# Altium schematic sheet USB_Isolator.SchDoc
size A4; SheetNumber: 1; SheetTotal: 1
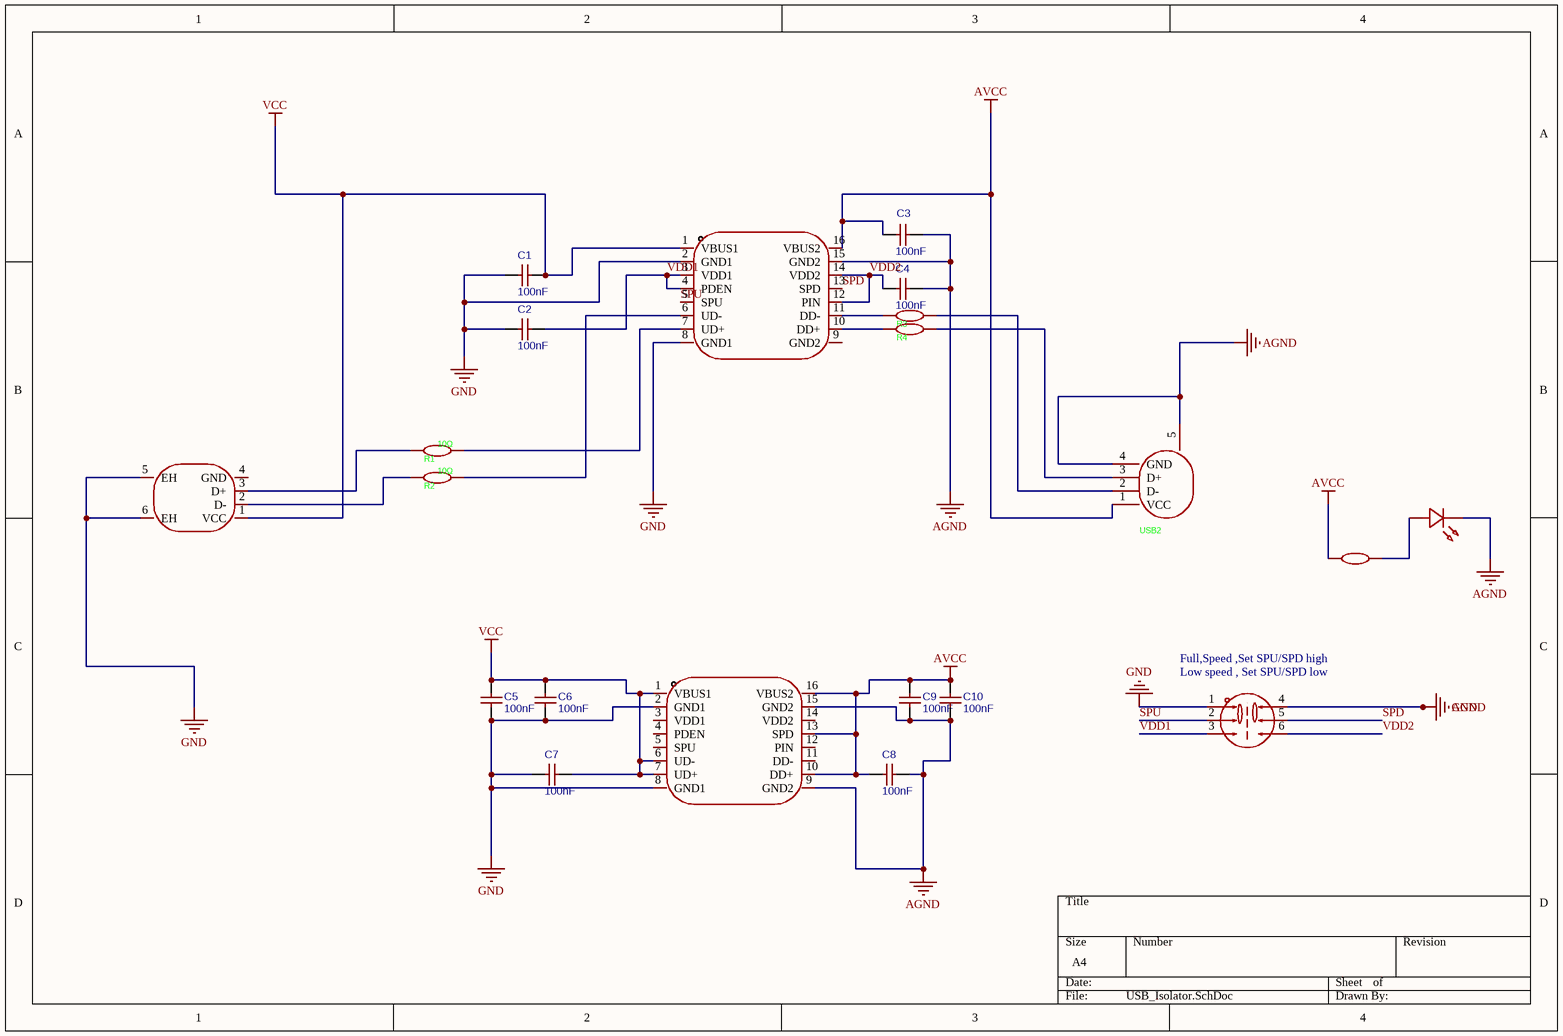
[diagram p0: USB_Isolator.SchDoc]

## Parts
C1  100nF  [100uF]
C2  100nF  [100uF]
C3  100nF  [100uF]
C4  100nF  [100uF]
C5  100nF  [100uF]
C6  100nF  [100uF]
C7  100nF  [100uF]
C8  100nF  [100uF]
C9  100nF  [100uF]
C10  100nF  [100uF]
LED1  XL-1608SURC-06  [LED]  (value not drawn)
R1  10Ω  [100K]
R2  10Ω  [100K]
R3  10Ω  [100K]  (value not drawn)
R4  10Ω  [100K]  (value not drawn)
R5  10Ω  [100K]  (value not drawn)
U2  KFC7070-Z  [Switch]  (value not drawn)
U?  ADUM4160BRWZ-RL  [USB ISOLATOR]  (value not drawn)
USB1  480372100  [USB MALE]  (value not drawn)
USB2  UE27AC54100  [USB TYPE- A]  (value not drawn)
USB_Isolator  ADUM4160BRWZ-RL  [USB ISOLATOR]  (value not drawn)

## Nets
AGND: C1.1 C2.1 C3.2 C4.2 C5.1 C6.1 C7.1 C8.2 C9.1 C10.1 LED1.1(K) U2.1 U2.4 U?.2(GND1) U?.8(GND1) U?.9(GND2) U?.15(GND2) USB1.5(EH) USB1.6(EH) USB2.4(GND) USB2.5(SHLD) USB_Isolator.2(GND1) USB_Isolator.8(GND1) USB_Isolator.15(GND2)  [also labelled GND]
AVCC: C3.1 C8.1 C9.2 C10.2 R5.1 U?.10(DD+) U?.13(SPD) U?.16(VBUS2) USB2.1(VCC) USB_Isolator.16(VBUS2)
VCC: C1.2 C5.2 C6.2 C7.2 U?.1(VBUS1) U?.6(UD-) U?.7(UD+) USB1.1(VCC) USB_Isolator.1(VBUS1)
SPD: U2.5 USB_Isolator.13(SPD)
SPU: U2.2 USB_Isolator.5(SPU)
VDD1: C2.2 U2.3 USB_Isolator.3(VDD1) USB_Isolator.4(PDEN)
VDD2: C4.1 U2.6 USB_Isolator.12(PIN) USB_Isolator.14(VDD2)
NetLED1_2: LED1.2(A) R5.2
NetR1_1: R1.1 USB1.3(D+)
NetR1_2: R1.2 USB_Isolator.7(UD+)
NetR2_1: R2.1 USB1.2(D-)
NetR2_2: R2.2 USB_Isolator.6(UD-)
NetR3_1: R3.1 USB_Isolator.11(DD-)
NetR3_2: R3.2 USB2.2(D-)
NetR4_1: R4.1 USB_Isolator.10(DD+)
NetR4_2: R4.2 USB2.3(D+)

Not connected (* = marked no-connect by the designer): U? 3(VDD1) 4(PDEN) 5(SPU) 11(DD-) 12(PIN) 14(VDD2); USB1 4(GND); USB_Isolator 9(GND2)

## Notes on the sheet
- (near U2) Full,Speed ,Set SPU/SPD high
- (near U2) Low speed , Set SPU/SPD low

## Library data of the parts
C1-C10 = 10uF: Manufacturer: SAMSUNG(三星); Manufacturer Part: CL10B104KO8NNNC; nameAlias: Value; Supplier: LCSC; Supplier Part: C66501; JLCPCB Part Class: Extended Part; spicePre: C; spiceSymbolName: CL10B104KO8NNNC
LED1 = LED: Manufacturer: XINGLIGHT(成兴光); Add into BOM: yes; Illumination Color: Red; Voltage - Forward(Vf): 2.3V; Power(Watts): 50mW; Forward Current: 20mA; Wavelength - Dominant: 620nm~630nm; Peak Wavelength: 625nm; Lens Color: Colorless Transparent Lens; Luminous Intensity: 225mcd; Viewing Angle: 120°; Mounting Sytle: Positive Stick; Symbol: XL-1608SURC-06; Device: XL-1608SURC-06; LCSC Part Name: XL-1608SURC-06; Supplier Part: C965799; Manufacturer Part: XL-1608SURC-06; Supplier Footprint: 0603; JLCPCB Part Class: Extended Part; Datasheet: https://atta.szlcsc.com/upload/public/pdf/source/20250213/F9766CE804AF391355DCDD48DB3E0DAB.pdf; Supplier: LCSC; Convert to PCB: yes; Lamp Holder Type: -; Diode Configuration: -; Color Temperature: -; Operating Temperature: -20℃~+85℃
R1-R5 = 10k: Manufacturer: YAGEO(国巨); Symbol: RC0603FR-0710RL; Add into BOM: yes; Tolerance: ±1%; Temperature Coefficient: ±200ppm/℃; Device: RC0603FR-0710RL; LCSC Part Name: 厚膜电阻 10Ω ±1% 100mW; Supplier Part: C109318; Manufacturer Part: RC0603FR-0710RL; Supplier Footprint: 0603; JLCPCB Part Class: Extended Part; Datasheet: https://atta.szlcsc.com/upload/public/pdf/source/20180316/70C0E2BDAE7FCC62C531A5A58D202EE1.pdf; Supplier: LCSC; Convert to PCB: yes; Type: Thick Film Resistors; Value: 10Ω; Operating Temperature Range: -55℃~+155℃
U2 = switch: Manufacturer: HanElectricity(瀚源); Add into BOM: yes; Symbol: KFC7070-Z; Device: KFC7070-Z; LCSC Part Name: KFC7070-Z; Supplier Part: C22459508; Manufacturer Part: KFC7070-Z; Supplier Footprint: DIP-6P,7x7mm; JLCPCB Part Class: Extended Part; Datasheet: https://atta.szlcsc.com/upload/public/pdf/source/20240605/2F47BAB787CC6253D9F5B83C0B3B0039.pdf; Supplier: LCSC; Convert to PCB: yes
U? = DC TO DC: Manufacturer: ADI(亚德诺); Device: ADUM4160BRWZ-RL_C57791; Add into BOM: yes; Symbol: ADUM4160BRWZ; LCSC Part Name: 全速/低速5kVUSB数字隔离器; Supplier Part: C57791; Manufacturer Part: ADUM4160BRWZ-RL; Supplier Footprint: SOIC-16-300mil; JLCPCB Part Class: Extended Part; Datasheet: https://atta.szlcsc.com/upload/public/pdf/source/20180327/C57791_1A1DC0BD2A9501538E79ECF10A1F69DF.pdf; Supplier: LCSC; Convert to PCB: yes
USB1 = USB MALE: Manufacturer: MOLEX; Symbol: 48037-2100; Add into BOM: yes; Connector Type: Type-A; Protocol Standard: USB 2.0; Gender: Male; Number of Contacts: 4P; Number of Ports: 1; Device: 480372100; LCSC Part Name: Type-A 公; Supplier Part: C136453; Manufacturer Part: 480372100; Supplier Footprint: SMD; JLCPCB Part Class: Extended Part; Datasheet: https://www.molex.com/content/dam/molex/molex-dot-com/products/automated/en-us/salesdrawingpdf/480/48037/480372100_sd.pdf?inline; Supplier: LCSC; Convert to PCB: yes
USB2 = UE27AC54100: Manufacturer: Amphenol; Add into BOM: yes; Connector Type: Type-A; Gender: Female; Number of Ports: 1; Number of Contacts: 4P; Symbol: UE27AC54100; Device: UE27AC54100; LCSC Part Name: Type-A 母 弯插; Supplier Part: C464564; Manufacturer Part: UE27AC54100; Supplier Footprint: 插件; JLCPCB Part Class: Extended Part; Datasheet: https://atta.szlcsc.com/upload/public/pdf/source/20191127/C464564_498EB86BBE5CA23622B07688CAA735B5.pdf; Supplier: LCSC; Convert to PCB: yes; Standard: USB 2.0; Mounting Style: Right-Angle; Current Rating - Power (Max): -; Operating Temperature Range: -40℃~+85℃
USB_Isolator = ADUM4160BRWZ-RL_C57791: Manufacturer: ADI(亚德诺); Add into BOM: yes; Symbol: ADUM4160BRWZ; Device: ADUM4160BRWZ-RL_C57791; LCSC Part Name: 全速/低速5kVUSB数字隔离器; Supplier Part: C57791; Manufacturer Part: ADUM4160BRWZ-RL; Supplier Footprint: SOIC-16-300mil; JLCPCB Part Class: Extended Part; Datasheet: https://atta.szlcsc.com/upload/public/pdf/source/20180327/C57791_1A1DC0BD2A9501538E79ECF10A1F69DF.pdf; Supplier: LCSC; Convert to PCB: yes